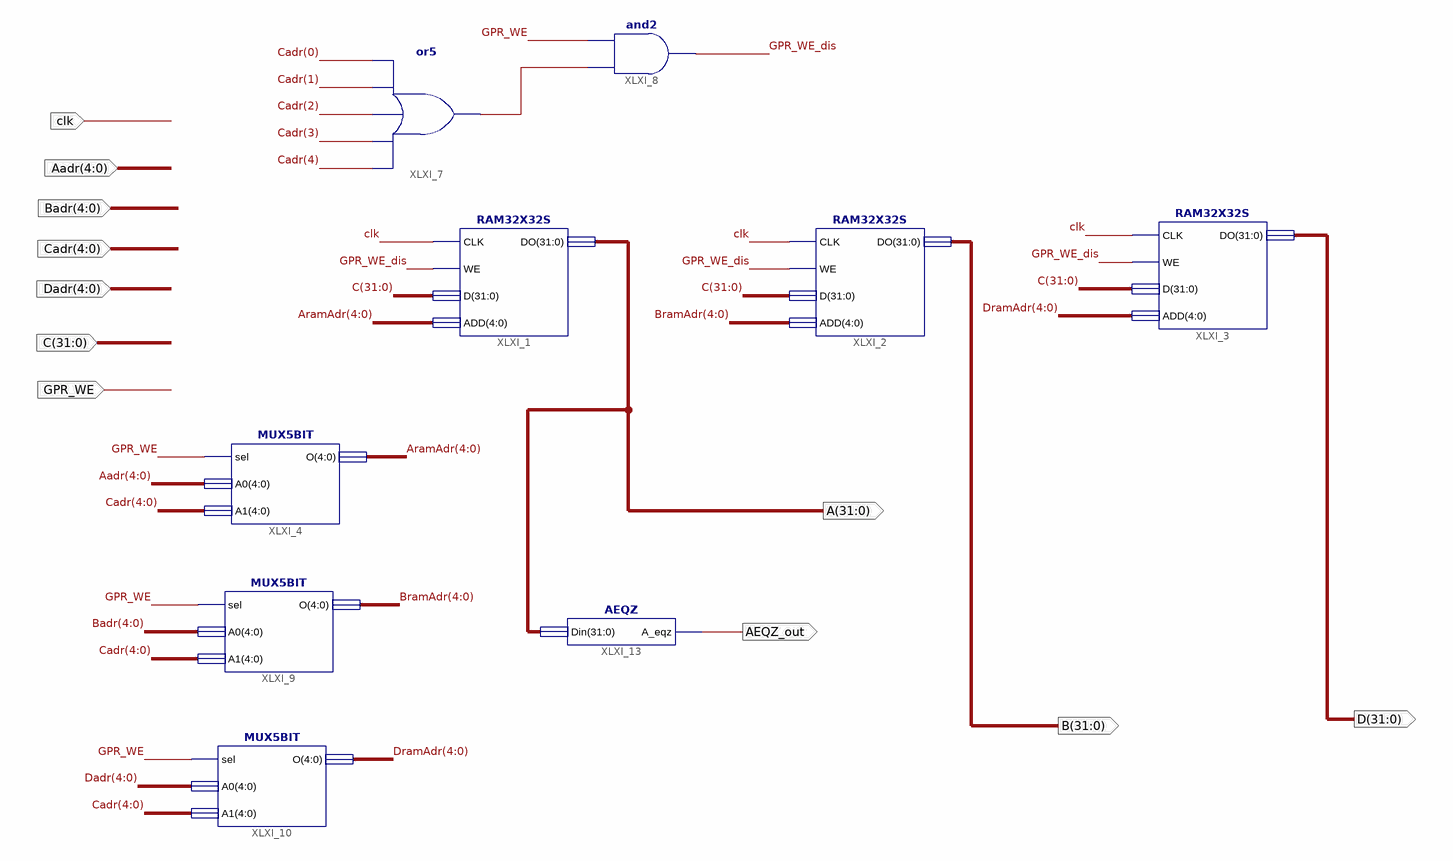
[diagram p0: schematic sheet 1]
// Xilinx ISE schematic GPR_Env.sch (spartan6) as structural Verilog: 9 symbols, 11 ports
module GPR_Env (
  input  clk,
  input  [4:0] Aadr,
  input  [4:0] Badr,
  input  [4:0] Cadr,
  input  [4:0] Dadr,
  input  [31:0] C,
  input  GPR_WE,
  output AEQZ_out,
  output [31:0] A,
  output [31:0] B,
  output [31:0] D
);

  wire GPR_WE_dis, XLXN_16;
  wire [4:0] AramAdr, BramAdr, DramAdr;

  RAM32X32S XLXI_1 (.CLK(clk), .WE(GPR_WE_dis), .D(C), .ADD(AramAdr), .DO(A));
  RAM32X32S XLXI_2 (.CLK(clk), .WE(GPR_WE_dis), .D(C), .ADD(BramAdr), .DO(B));
  RAM32X32S XLXI_3 (.CLK(clk), .WE(GPR_WE_dis), .D(C), .ADD(DramAdr), .DO(D));
  MUX5BIT XLXI_4 (.sel(GPR_WE), .A0(Aadr), .A1(Cadr), .O(AramAdr));
  or XLXI_7 (XLXN_16, Cadr[4], Cadr[3], Cadr[2], Cadr[1], Cadr[0]);
  and XLXI_8 (GPR_WE_dis, XLXN_16, GPR_WE);
  MUX5BIT XLXI_9 (.sel(GPR_WE), .A0(Badr), .A1(Cadr), .O(BramAdr));
  MUX5BIT XLXI_10 (.sel(GPR_WE), .A0(Dadr), .A1(Cadr), .O(DramAdr));
  AEQZ XLXI_13 (.Din(A), .A_eqz(AEQZ_out));
endmodule
